# Altium schematic sheet Source.SchDoc
size A3
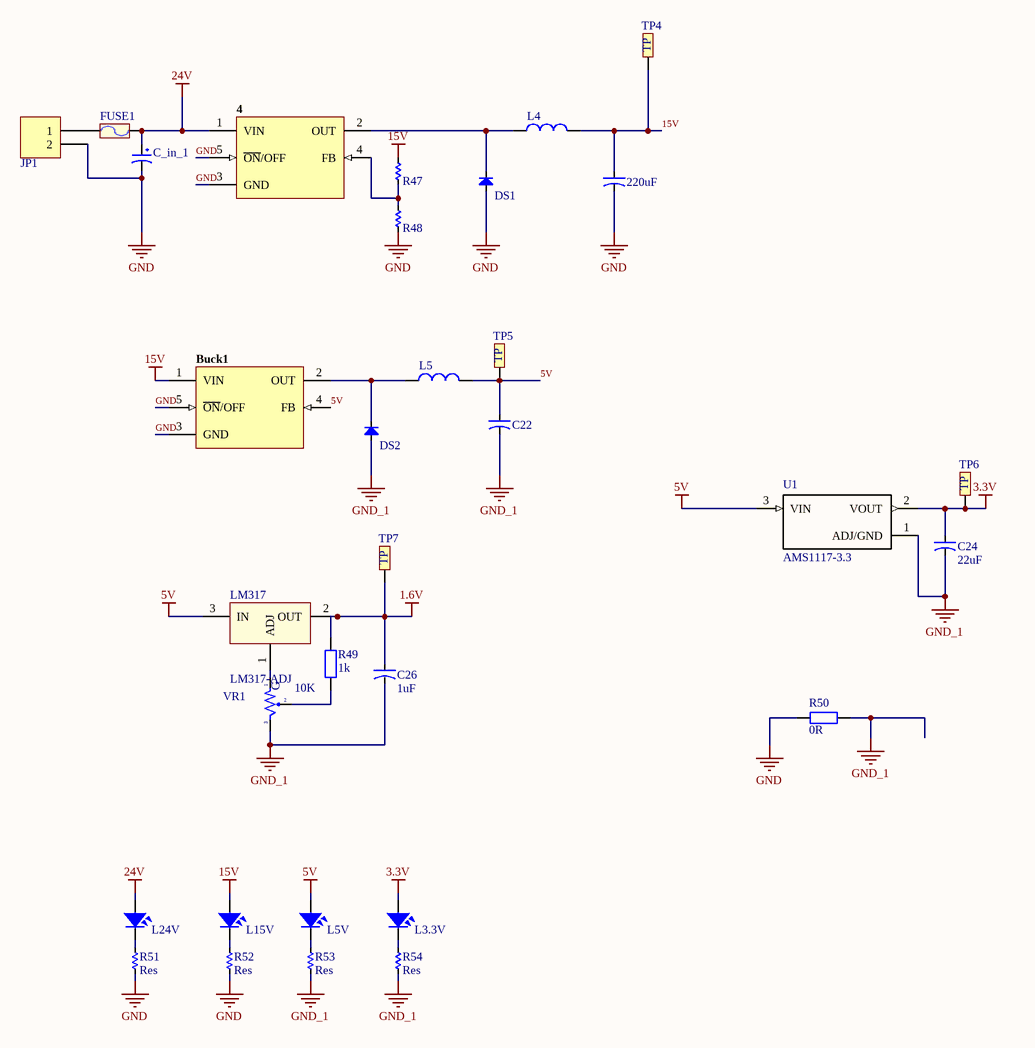
[diagram p0: Source.SchDoc]

## Parts
4  LM2576-ADJ  [TO263]  (value not drawn)
220uF  CN-ALU-DIP  [CA-ALU-5R]  (value not drawn)
Buck1  LM2576-5V  [TO263]  (value not drawn)
C22  >400uF  [CA-ALU-5R]  (value not drawn)
C24  22uF  [CA-ALU-2.54]
C26  1uF  [CA-ALU-2.54]
C_in_1  100->220uF  [CP1.5/3.4]  (value not drawn)
DS1  Diode  [DIO-1A]  (value not drawn)
DS2  Diode  [DIO-1A]  (value not drawn)
FUSE1  F1A  [Fuse1]  (value not drawn)
JP1  Header 2_1  [HED2]  (value not drawn)
L3.3V  LED  [LED-5-BLUE]  (value not drawn)
L4  100uH  [L01]  (value not drawn)
L5  (no value)  [L01]
L5V  LED  [LED-5-BLUE]  (value not drawn)
L15V  LED  [LED-5-BLUE]  (value not drawn)
L24V  LED  [LED-5-BLUE]  (value not drawn)
LM317  LM317-ADJ  [TO220H3]
R47  20-24  [RES-1/2W]  (value not drawn)
R48  2  [RES-1/2W]  (value not drawn)
R49  1k  [R1/4W]
R50  0R  [R1/4W]
R51  Res  [RES-1/2W]
R52  Res  [RES-1/2W]
R53  Res  [RES-1/2W]
R54  Res  [RES-1/2W]
TP4  (no value)  [TP]
TP5  (no value)  [TP]
TP6  (no value)  [TP]
TP7  (no value)  [TP]
U1  AMS1117-3.3  [*SOT229P700X180-4N]
VR1  10K  [VR-S2]

## Nets
1.6V: C26.1 LM317.2(OUT) R49.2 TP7.TP1
3.3V: C24.1 L3.3V.1 TP6.TP1 U1.2(VOUT)
5V: Buck1.4(FB) C22.1 L5.2 L5V.1 LM317.3(IN) TP5.TP1 U1.3(VIN)
15V: 220uF.1 Buck1.1(VIN) L4.2 L15V.1 R47.1 TP4.TP1
24V: 4.1(VIN) C_in_1.1 FUSE1.2 L24V.1
GND: 4.3(GND) 4.5(~{ON}/OFF) 220uF.2 Buck1.3(GND) Buck1.5(~{ON}/OFF) C_in_1.2 DS1.1(A) JP1.2 R48.2 R50.2 R51.2 R52.2
GND_1: C22.2 C24.2 C26.2 DS2.1(A) R50.1 R53.2 R54.2 U1.1(ADJ/GND) VR1.3
Net4_2: 4.2(OUT) DS1.2(K) L4.1
Net4_4: 4.4(FB) R47.2 R48.1
NetBuck1_2: Buck1.2(OUT) DS2.2(K) L5.1
NetFUSE1_1: FUSE1.1 JP1.1
NetL3.3V_2: L3.3V.2 R54.1
NetL5V_2: L5V.2 R53.1
NetL15V_2: L15V.2 R52.1
NetL24V_2: L24V.2 R51.1
NetLM317_1: LM317.1(ADJ) VR1.1
NetR49_1: R49.1 VR1.2

## Notes on the sheet
- (in symbol VR-S) G

## Library data of the parts
4 Buck1 = LM2576: Max Input Voltage: 12 V; Max Output Current: 3 (6.0 peak) A; Max Output Voltage: mV; Category: IC-Power; Min Input Voltage: mV; Min Output Voltage: mV; Mounting Technology: Surface Mount; Status: Unreleased; Supply Voltage: mV; Temperature Range: -40 to +125 degC
220uF C22 C24 C26 = CN-ALU-DIP: Capacitor (Semiconductor SIM Model); Value: 104; LatestRevisionDate: 17-Jul-2002; LatestRevisionNote: Re-released for DXP Platform.; PackageReference: C1206; Publisher: Altium Limited
C_in_1 = CP4: Cap 1000uF/16V - 220uF/50V; Description 5: 4,7uF>10uF/250V_3,3uF>10uF/400V - 2,2uF>4,7uF/450V; Description 1: 2200uF-3300uF/6,3V - 1000uF-2200uF/10V; Description 2: 1000uF/16V - 470uF => 1000uF/25V - 100uF/100V; Description 3: 330uF>470uF/35V_220uF>470uF/50V_10uF>22uF/250V; Description 4: 220uF => 330uF/63V - 10uF =>33uF/160 - 200V; Value: 1000uF/16V
DS1 DS2 = Diode: Default Diode; Code - JEDEC: DO-214-AB; Value: 1N5007; Published: 8-Jun-2000; Revision: July-2002: Re-released for DXP Platform.; Publisher: Altium Limited
FUSE1 = Fuse: Designed by: VanDungEvn; Value: Fuse
JP1 = Header 2_1: Header, 2-Pin; Manufacturer: Generic Components; Class: Connector; Value: Header 2
L3.3V L5V L15V L24V = LED: LED Single colour Green and Red; Value: LED 3 ly Single Colour
L4 L5 = L1: Inductor; Value: 150 mH
LM317 = LM317: Adj Voltage +1.2 -> +37V; Value: LM317
R47 R48 R51-R54 = Res: Manufacturer: Generic Components; Class: Passive; SubClass: R; Published: 08/06/2000; Publisher: Altium Hobart Technology Centre
R49 R50 = R1/4W: Resistor 1/4W; Value: R1/4W - 1K
TP4-TP7 = TP: CONNECT 1
U1 = AMS1117-3.3: Sot223/Pkg 1-Amp 3.3-Volt Low Drop Out Voltage Regulatator; MF: Advanced Monolithic Systems; Availability: Unavailable; SnapEDA_Link: https://www.snapeda.com/parts/AMS1117-3.3/Advanced%20Monolithic%20Systems/view-part/53450/?ref=snap; Price: None; Package: None; MP: AMS1117-3.3; Value: *
VR1 = VR-S: Var Resistor; Value: Volume 50k